# Altium schematic sheet 03 MAIN POWER.SchDoc
size 513 x 386 mm
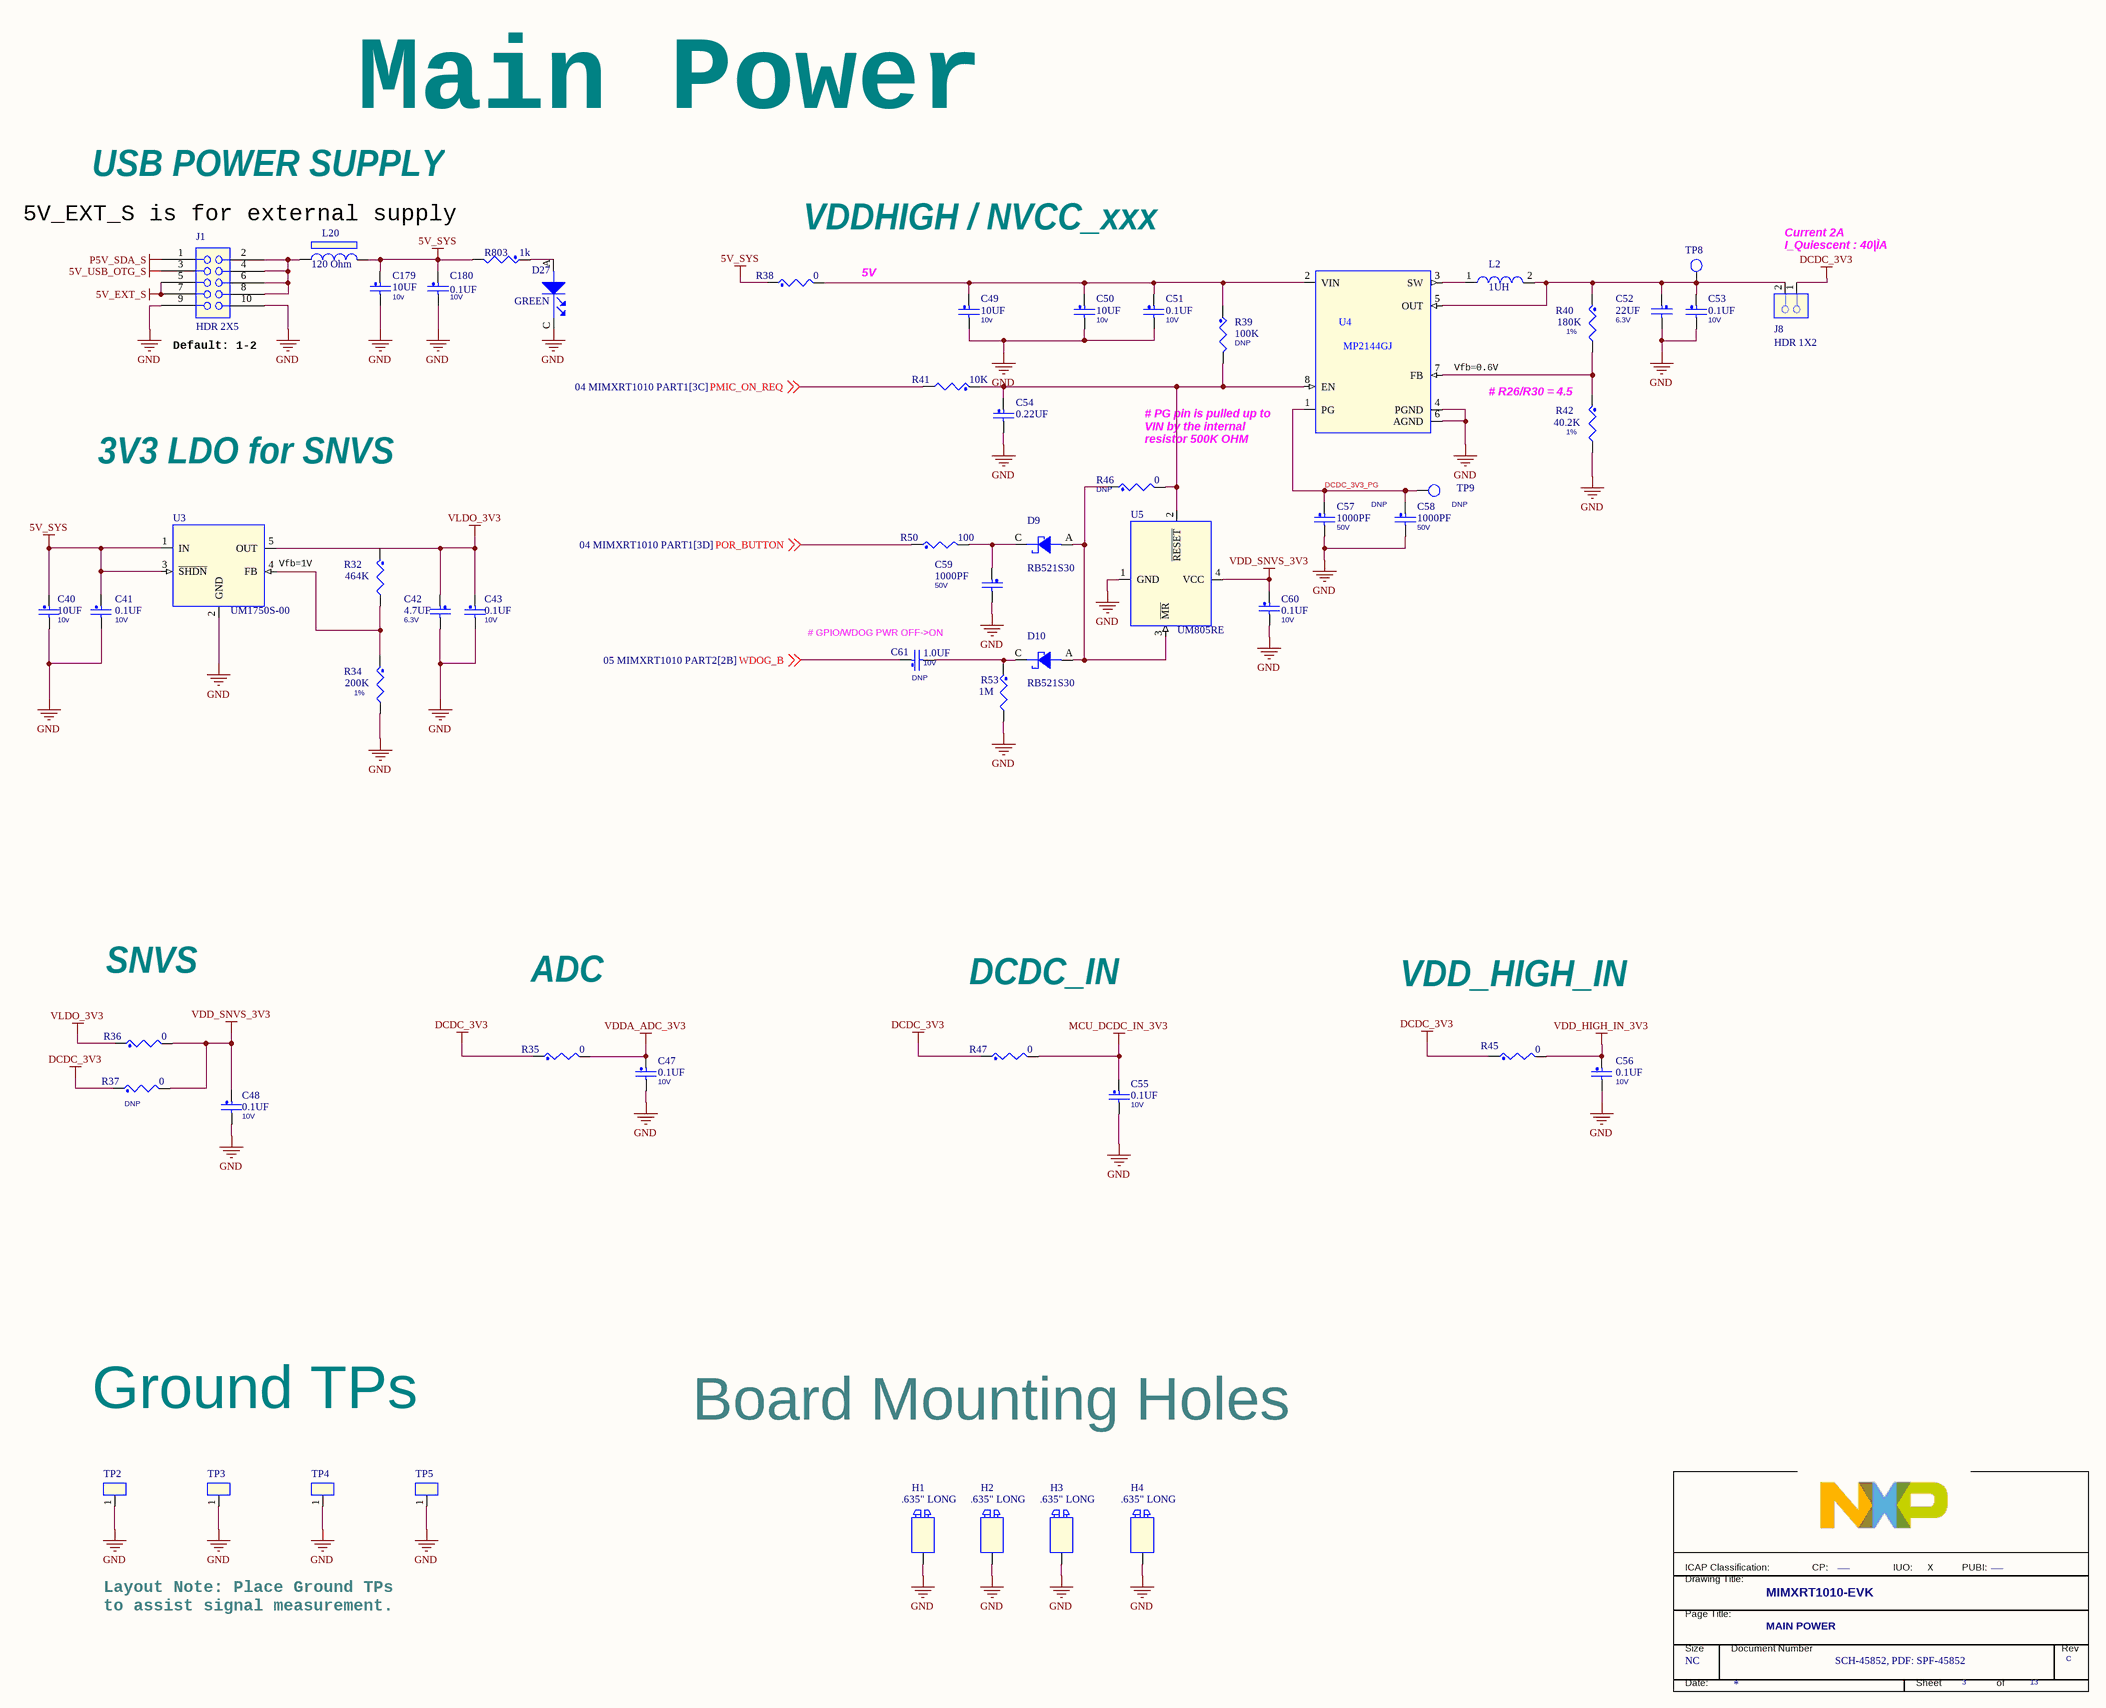
[diagram p0: 03 MAIN POWER.SchDoc]

## Parts
*  PUBI: ___  Doc: SCH-45852, PDF: SPF-45852  RevCode: C  Title: MIMXRT1010-EVK  Page Size: NC  Page Number: 3  Page Count: 13  PageTitle: MAIN POWER  (hidden comment: TitleBlock_FS)  (graphical)
C40  10UF  VOLTAGE: 10v  [CC0603_OV]
C41  0.1UF  VOLTAGE: 10V  [CC0402_25]
C42  4.7UF  voltage rating: 6.3V  [0402_CC]
C43  0.1UF  VOLTAGE: 10V  [CC0402_25]
C47  0.1UF  VOLTAGE: 10V  [CC0402_25]
C48  0.1UF  VOLTAGE: 10V  [CC0402_25]
C49  10UF  VOLTAGE: 10v  [CC0603_OV]
C50  10UF  VOLTAGE: 10v  [CC0603_OV]
C51  0.1UF  VOLTAGE: 10V  [CC0402_25]
C52  22UF  voltage rating: 6.3V  [0603_CC]
C53  0.1UF  VOLTAGE: 10V  [CC0402_25]
C54  0.22UF  [0402_CC]
C55  0.1UF  VOLTAGE: 10V  [CC0402_25]
C56  0.1UF  VOLTAGE: 10V  [CC0402_25]
C57  1000PF  ASSY_OPT: DNP  VOLTAGE: 50V  [0402_CC]
C58  1000PF  ASSY_OPT: DNP  VOLTAGE: 50V  [0402_CC]
C59  1000PF  VOLTAGE: 50V  [0402_CC]
C60  0.1UF  VOLTAGE: 10V  [CC0402_25]
C61  1.0UF  ASSY_OPT: DNP  VOLTAGE: 10V  [0402_cc]
C179  10UF  VOLTAGE: 10v  [CC0603_OV]
C180  0.1UF  VOLTAGE: 10V  [CC0402_25]
D9  RB521S30  [SOD523]
D10  RB521S30  [SOD523]
D27  GREEN  [LED_0603]
H1  .635" LONG  [spacer_139t]
H2  .635" LONG  [spacer_139t]
H3  .635" LONG  [spacer_139t]
H4  .635" LONG  [spacer_139t]
J1  HDR 2X5  [hdr205]
J8  HDR 1X2  [HDR102]
L2  1UH  [ind_4020]
L20  120 Ohm  [0402_CC]
R32  464K  [0402_CC]
R34  200K  Tolerance: 1%  [0402_CC]
R35  0  [0402_CC]
R36  0  [0402_CC]
R37  0  ASSY_OPT: DNP  [0402_CC]
R38  0  [0402_CC]
R39  100K  ASSY_OPT: DNP  [0402_CC]
R40  180K  Tolerance: 1%  [0402_CC]
R41  10K  [0402_CC]
R42  40.2K  Tolerance: 1%  [0402_CC]
R45  0  [0402_CC]
R46  0  ASSY_OPT: DNP  [0402_CC]
R47  0  [0402_CC]
R50  100  [0402_CC]
R53  1M  [0402_CC]
R803  1k  [0402_CC]
TP2  5006  [tp_th_063]  (value not drawn)
TP3  5006  [tp_th_063]  (value not drawn)
TP4  5006  [tp_th_063]  (value not drawn)
TP5  5006  [tp_th_063]  (value not drawn)
TP8  TP_35MIL  [testpoint_35mil]  (value not drawn)
TP9  TP_35MIL  [testpoint_35mil]  (value not drawn)
U3  UM1750S-00  [sot23-5_a]
U4  MP2144GJ  [tsot23_8_0p65_2x1]
U5  UM805RE  [sot_143]

## Nets
5V_EXT_S: J1.5(A3) J1.7(A4)
5V_SYS: C40.1 C41.1 C179.1 C180.1 L20.2 R38.1 R803.2 U3.1(IN) U3.3(~{SHDN})
5V_USB_OTG_S: J1.3(A2)
DCDC_3V3: J8.1 R35.1 R37.1 R45.1 R47.1
GND: C40.2 C41.2 C42.2 C43.2 C47.2 C48.2 C49.2 C50.2 C51.2 C52.2 C53.2 C54.2 C55.2 C56.2 C57.2 C58.2 C59.2 C60.2 C179.2 C180.2 D27.C(CATHODE) H1.1(NC_1) H2.1(NC_1) H3.1(NC_1) H4.1(NC_1) J1.9(A5) J1.10(B5) R34.2 R42.2 R53.2 TP2.1 TP3.1 TP4.1 TP5.1 U3.2(GND) U4.4(PGND) U4.6(AGND) U5.1(GND)
MCU_DCDC_IN_3V3: C55.1 R47.2
P5V_SDA_S: J1.1(A1)
VDD_HIGH_IN_3V3: C56.1 R45.2
VDD_SNVS_3V3: C48.1 C60.1 R36.2 R37.2 U5.4(VCC)
VDDA_ADC_3V3: C47.1 R35.2
VLDO_3V3: C42.1 C43.1 R32.1 R36.1 U3.5(OUT)
DCDC_3V3_PG: C57.1 C58.1 TP9.1(TP) U4.1(PG)
PMIC_ON_REQ: R41.2 ; off-sheet PMIC_ON_REQ
POR_BUTTON: R50.1 ; off-sheet POR_BUTTON
WDOG_B: C61.1 ; off-sheet WDOG_B
NetC49_1: C49.1 C50.1 C51.1 R38.2 R39.1 U4.2(VIN)
NetC52_1: C52.1 C53.1 J8.2 L2.2 R40.1 TP8.1(TP) U4.5(OUT)
NetC54_1: C54.1 R39.2 R41.1 R46.2 U4.8(EN) U5.2(~{RESET})
NetC59_1: C59.1 D9.C R50.2
NetC61_2: C61.2 D10.C R53.1
NetD9_A: D9.A D10.A R46.1 U5.3(~{MR})
NetD27_A: D27.A(ANODE) R803.1
NetJ1_2: J1.2(B1) J1.4(B2) J1.6(B3) J1.8(B4) L20.1
NetL2_1: L2.1 U4.3(SW)
NetR32_2: R32.2 R34.1 U3.4(FB)
NetR40_2: R40.2 R42.1 U4.7(FB)

## Notes on the sheet
- Main Power
- 5V_EXT_S is for external supply
- USB POWER SUPPLY
- VDDHIGH / NVCC_xxx
- 5V
- (near J8) Current 2A
  I_Quiescent : 40|ÌA
- (near J1) Default: 1-2
- (near U4) Vfb=0.6V
- (near R42) # R26/R30 = 4.5
- (near U4) # PG pin is pulled up to
  VIN by the internal
  resistor 500K OHM
- 3V3 LDO for SNVS
- (near U3) Vfb=1V
- (near C61) # GPIO/WDOG PWR OFF->ON
- SNVS
- ADC
- DCDC_IN
- VDD_HIGH_IN
- Ground TPs
- Board Mounting Holes
- Layout Note: Place Ground TPs
  to assist signal measurement.
- X
- (in symbol TitleBlock_FS) ICAP Classification:; CP:; IUO:; PUBI:; Drawing Title:; Page Title:; Size; Document Number; Rev; Date:; Sheet; of

## Library data of the parts
* = TitleBlock_FS: FIUO: _X_; OrgAddr2: Austin, TX 78735-8598; OrgAddr1: 6501 William Cannon Drive West; OrgName: Freescale Semiconductor; FCP: ___; Page Create Date: March  8, 1995; Page Modify Date: *
C40 C49 = CAP_NP: CAP CER 10UF 10V 10% X5R 0603; CLASS: DISCRETE; FPLIST: CC0603_OV,CC0603,0603_CC; CAD_APPROVED: Yes; Temp_Range: -55¡ãC ~ 85¡ãC; MFG_PN01: GRM188R61A106KE69D; MFG_NAME01: MURATA; AGILE_PN: 150-78675; PCB Footprint: CC0603_OV; HEIGHT: 1.016MM; ROHS: Yes; Tolerance: 10%
C41 C43 C47 C48 C55 C56 = CAP_NP: CAP CER 0.1UF 10V 10% X5R 0402; CLASS: DISCRETE; FPLIST: CC0402_25,CC0402_HD,0402_CC; CAD_APPROVED: Yes; MFG_PN01: CC0402KRX5R6BB104; MFG_NAME01: YAGEO AMERICA; AGILE_PN: 150-75634; PCB Footprint: CC0402_25; HEIGHT: 0.64MM; ROHS: Yes; Tolerance: 10%
C42 = CAP_NP: CAP CER 4.7UF 6.3V 20% X5R 0402; CLASS: DISCRETE; FPLIST: CC0402_25,CC0402_HD,0402_CC; CAD_APPROVED: Yes; MFG_PN01: C1005X5R0J475M050BC; MFG_NAME01: TDK; AGILE_PN: 150-78463; PCB Footprint: 0402_CC; HEIGHT: 0.65MM; ROHS: Yes; Tolerance: 20%; VOLTAGE: 6.3V
C50 C179 = CAP_NP: CAP CER 10UF 10V 10% X5R 0603; CLASS: DISCRETE; AGILE_PN: 150-78675; MFG_NAME01: MURATA; MFG_PN01: GRM188R61A106KE69D; Temp_Range: -55¡ãC ~ 85¡ãC; CAD_APPROVED: Yes; FPLIST: CC0603_OV,CC0603,0603_CC; PCB Footprint: CC0603_OV; Tolerance: 10%; ROHS: Yes; HEIGHT: 1.016MM
C51 C53 C60 C180 = CAP_NP: CAP CER 0.1UF 10V 10% X5R 0402; CLASS: DISCRETE; AGILE_PN: 150-75634; MFG_NAME01: YAGEO AMERICA; MFG_PN01: CC0402KRX5R6BB104; CAD_APPROVED: Yes; FPLIST: CC0402_25,CC0402_HD,0402_CC; PCB Footprint: CC0402_25; Tolerance: 10%; ROHS: Yes; HEIGHT: 0.64MM
C52 = CAP_NP: CAP CER 22UF 6.3V 20% X5R 0603; CLASS: DISCRETE; AGILE_PN: 150-78467; MFG_NAME01: Samsung; MFG_PN01: CL10A226MQ8NRNE; CAD_APPROVED: Yes; FPLIST: CC0603_OV,CC0603,0603_CC; PCB Footprint: 0603_CC; Tolerance: 20%; ROHS: Yes; HEIGHT: 1MM; VOLTAGE: 6.3V
C54 = CAP_NP: CAP CER 0.22UF 6.3V 20% X5R 0402; CLASS: DISCRETE; AGILE_PN: 150-76271; MFG_NAME01: KEMET; MFG_PN01: C0402C224M9PAC; CAD_APPROVED: Yes; FPLIST: CC0402_25,CC0402_HD,0402_CC; PCB Footprint: 0402_CC; Tolerance: 20%; ROHS: Yes; HEIGHT: 0.55MM; VOLTAGE: 6.3V
C57 = CAP_NP: CAP CER 1000PF 50V 5% C0G 0402; CLASS: DISCRETE; FPLIST: CC0402_25,CC0402_HD,0402_CC; CAD_APPROVED: Yes; MFG_PN01: GRM1555C1H102JA01D; MFG_NAME01: MURATA; AGILE_PN: 150-76334; PCB Footprint: 0402_CC; HEIGHT: 0.55MM; ROHS: Yes; Tolerance: 5%
C58 C59 = CAP_NP: CAP CER 1000PF 50V 5% C0G 0402; CLASS: DISCRETE; AGILE_PN: 150-76334; MFG_NAME01: MURATA; MFG_PN01: GRM1555C1H102JA01D; CAD_APPROVED: Yes; FPLIST: CC0402_25,CC0402_HD,0402_CC; PCB Footprint: 0402_CC; Tolerance: 5%; ROHS: Yes; HEIGHT: 0.55MM
C61 = CAP_NP: CAP CER 1.0UF 10V 10% X5R 0402; CLASS: DISCRETE; FPLIST: CC0402_25,CC0402_HD,0402_CC; CAD_APPROVED: Yes; MFG_PN01: CC0402KRX5R6BB105; MFG_NAME01: YAGEO AMERICA; AGILE_PN: 150-75772; PCB Footprint: 0402_cc; HEIGHT: 0.6MM; ROHS: Yes
D9 = DIODE_SCHTKY: DIODE SCH RECT 200MA 30V AEC-Q101 SOD-523; CLASS: IC; AGILE_PN: 480-79672; MFG_NAME01: NEXPERIA; MFG_PN01: RB521S30,115; CAD_APPROVED: Yes; PCB Footprint: SOD523; ROHS: Yes; HEIGHT: 0.65MM
D10 = DIODE_SCHTKY: DIODE SCH RECT 200MA 30V AEC-Q101 SOD-523; CLASS: IC; CAD_APPROVED: Yes; MFG_PN01: RB521S30,115; MFG_NAME01: NEXPERIA; AGILE_PN: 480-79672; PCB Footprint: SOD523; HEIGHT: 0.65MM; ROHS: Yes
D27 = LED: LED GRN SGL 25MA 0603; CLASS: IC; AGILE_PN: 370-76549; MFG_NAME01: KINGBRIGHT; MFG_PN01: KPT-1608SGC; CAD_APPROVED: Yes; PCB Footprint: LED_0603; ROHS: Yes; HEIGHT: 0.85MM
H1-H4 = SPACER: FASTENER, STANDOFF 4.5MMX3.53XM3.0X0.5 ROUND THR .635"L BRASS; CLASS: IC; CAD_APPROVED: Yes; ASSY_OPT: DNP; MFG_PN01: MSS251-R-1-A-16; MFG_NAME01: UNICORP; AGILE_PN: 280-76498; PCB Footprint: spacer_139t; HEIGHT: 16.13MM; ROHS: Yes
J1 = CONN_HDR_5X2: HDR 2X5 TH 100MIL CTR 338H AU 98L; CLASS: IO; CAD_APPROVED: Yes; Temp_Range: -55DegC to +105DegC; MFG_PN01: 0902S1005011N9T-31RF; MFG_NAME01: ANYTRONIC CORPORATION LIMITED; AGILE_PN: 210-81467; PCB Footprint: hdr205; HEIGHT: 8.59MM; ROHS: Yes
J8 = CONN_HDR_2X1: HDR 1X2 TH 100MIL SP 339H AU 98L; CLASS: IO; AGILE_PN: 210-81490; MFG_NAME01: ANYTRONIC CORPORATION LIMITED; MFG_PN01: 0901S0202011N9T-31RF; Temp_Range: -55¡ãC to +105¡ãC; CAD_APPROVED: Yes; PCB Footprint: HDR102; ROHS: Yes; HEIGHT: 8.59MM
L2 = IND: IND PWR 1UH@100KHZ 2.6A 30% SMT; PART_TYPE: INDUCTOR\POWER; CLASS: DISCRETE; AGILE_PN: 180-77797; MFG_NAME01: Shenzhen Sunlord Electronics Co., Ltd; MFG_PN01: SWPA4020S1R0NT; CAD_APPROVED: Yes; PCB Footprint: ind_4020; Tolerance: 30%; TOL: 30%; ROHS: Yes; HEIGHT: 2.2MM
L20 = INDUCTOR_FERRITE: IND FER BEAD 120 OHM@100MHZ 0.5A 25% 0402; PART_TYPE: FERRITE\BEAD; CLASS: DISCRETE; FPLIST: IND_0402,0402_CC; CAD_APPROVED: Yes; MFG_PN01: BLM15AG121SN1D; MFG_NAME01: Murata; AGILE_PN: 180-77771; PCB Footprint: 0402_CC; HEIGHT: 0.55MM; ROHS: Yes; Tolerance: 25%
R32 = RES_Dup1: RES MF 464K 1/10W 1% AEC-Q200 0402; CLASS: DISCRETE; Temp_Range: -55C to +155C; AGILE_PN: 470-31135; MFG_NAME01: KOA SPEER; MFG_PN01: RK73H1ETTP4643F; CAD_APPROVED: Yes; FPLIST: RC0402_25,RC0402_HD,0402_CC; PCB Footprint: 0402_CC; Tolerance: 1%; ROHS: Yes; HEIGHT: 0.40 MM
R34 = RES_Dup1: RES MF 200K 1/10W 1% AEC-Q200 0402; CLASS: DISCRETE; AGILE_PN: 470-31093; MFG_NAME01: KOA SPEER; MFG_PN01: RK73H1ETTP2003F; CAD_APPROVED: Yes; FPLIST: RC0402_25,RC0402_HD,0402_CC; Temp_Range: -55C to +155C; PCB Footprint: 0402_CC; HEIGHT: 0.40 MM; ROHS: Yes
R35 R36 R38 R47 = RES_Dup1: RES MF ZERO OHM 1/16W 5% 0402; CLASS: DISCRETE; FPLIST: RC0402_25,RC0402_HD,RC0402_X2,0402_CC; CAD_APPROVED: Yes; MFG_PN01: MCR01MZPJ000; MFG_NAME01: ROHM; AGILE_PN: 470-75394; PCB Footprint: 0402_CC; ROHS: Yes; Tolerance: 5%; HEIGHT: 0.45 MM
R37 R45 R46 = RES_Dup1: RES MF ZERO OHM 1/16W 5% 0402; CLASS: DISCRETE; AGILE_PN: 470-75394; MFG_NAME01: ROHM; MFG_PN01: MCR01MZPJ000; CAD_APPROVED: Yes; FPLIST: RC0402_25,RC0402_HD,RC0402_X2,0402_CC; PCB Footprint: 0402_CC; HEIGHT: 0.45 MM; Tolerance: 5%; ROHS: Yes
R39 = RES_Dup1: RES MF 100K 1/16W 5% 0402; CLASS: DISCRETE; FPLIST: RC0402_25,RC0402_HD,0402_CC; CAD_APPROVED: Yes; MFG_PN01: CR0402-16W-104JT; MFG_NAME01: VENKEL COMPANY; AGILE_PN: 470-75597; Temp_Range: -55C to +155C; PCB Footprint: 0402_CC; HEIGHT: 0.40 MM; ROHS: Yes; Tolerance: 5%
R40 = RES_Dup1: RES MF 180K 1/10W 1% AEC-Q200 0402; CLASS: DISCRETE; Temp_Range: -55C to +155C; FPLIST: RC0402_25,RC0402_HD,0402_CC; CAD_APPROVED: Yes; MFG_PN01: RK73H1ETTP1803F; MFG_NAME01: KOA SPEER; AGILE_PN: 470-31088; PCB Footprint: 0402_CC; HEIGHT: 0.40 MM; ROHS: Yes
R41 = RES_Dup1: RES MF 10K 1/16W 5% 0402; CLASS: DISCRETE; AGILE_PN: 470-75557; MFG_NAME01: VISHAY INTERTECHNOLOGY; MFG_PN01: CRCW040210K0JNED; CAD_APPROVED: Yes; FPLIST: RC0402_25,RC0402_HD,0402_CC; PCB Footprint: 0402_CC; Tolerance: 5%; ROHS: Yes; HEIGHT: 0.4 MM
R42 = RES_Dup1: RES MF 40.2K  1/16W 1% 0402; CLASS: DISCRETE; Temp_Range: -55C to +155C; FPLIST: RC0402_25,RC0402_HD,0402_CC; CAD_APPROVED: Yes; MFG_PN01: RC0402FR-0740K2L; MFG_NAME01: YAGEO AMERICA; AGILE_PN: 470-31015; PCB Footprint: 0402_CC; ROHS: Yes; HEIGHT: 0.40 MM
R50 = RES_Dup1: RES MF 100 OHM 1/16W 1% 0402; CLASS: DISCRETE; FPLIST: RC0402_25,RC0402_HD,0402_CC; CAD_APPROVED: Yes; MFG_PN01: CR-02FL6--100R; MFG_NAME01: THYE MING TECH CO LTD; AGILE_PN: 470-30454; PCB Footprint: 0402_CC; ROHS: Yes; Tolerance: 1%; HEIGHT: 0.4 MM
R53 = RES_Dup1: RES MF 1M 1/10W 5% AEC-Q200 0402; CLASS: DISCRETE; FPLIST: RC0402_25,RC0402_HD,0402_CC; CAD_APPROVED: Yes; MFG_PN01: RK73B1ETTP105J; MFG_NAME01: KOA SPEER; AGILE_PN: 470-79978; Temp_Range: -55&#8451; to 155&#8451;; PCB Footprint: 0402_CC; ROHS: Yes; Tolerance: 5%; HEIGHT: 0.4MM
R803 = RES_Dup1: RES MF 1.0K 1/16W 5% 0402; CLASS: DISCRETE; AGILE_PN: 470-75555; MFG_NAME01: VISHAY INTERTECHNOLOGY; MFG_PN01: CRCW04021K00JNED; CAD_APPROVED: Yes; FPLIST: RC0402_25,RC0402_HD,RC0402_X2,0402_CC; PCB Footprint: 0402_CC; Tolerance: 5%; ROHS: Yes; HEIGHT: 0.41mm
TP2 TP4 = TEST_POINT: TEST POINT BLK 70X220 MIL TH; CLASS: IC; CAD_APPROVED: Yes; MFG_NAME01: Keystone Electronics; AGILE_PN: 210-30155; PCB Footprint: tp_th_063; HEIGHT: 5.6MM; ROHS: Yes; MFG_PN01: 5006
TP3 TP5 = TEST_POINT: TEST POINT BLK 70X220 MIL TH; CLASS: IC; AGILE_PN: 210-30155; MFG_NAME01: Keystone Electronics; CAD_APPROVED: Yes; PCB Footprint: tp_th_063; MFG_PN01: 5006; ROHS: Yes; HEIGHT: 5.6MM
TP8 TP9 = T POINT R: TEST POINT PAD .035 SMT, no part to order; CLASS: IC; AGILE_PN: 510-75618; CAD_APPROVED: Yes; PCB Footprint: testpoint_35mil; ROHS: Yes; HEIGHT: 0.1MM
U3 = UM1750S-00_5P: IC VREG LDO ADJ 1-5V 350mA 2.5-6V SOT23-5; AGILE_PN: 315-80554; MFG_NAME01: Union Semiconductor, Inc; CAD_APPROVED: Yes; CLASS: IC; PCB Footprint: sot23-5_a; MFG_PN01: UM1750S-00; ROHS: Yes; HEIGHT: 1.25MM
U4 = MP2144GJ_TSOT23_8P: IC SYNC STEP-DOWN SW 1.2MHZ 0.6V 2A 2.5-5.5V TSOT23-8; AGILE_PN: 315-80508; MFG_NAME01: MONOLITHIC POWER SYSTEMS; CAD_APPROVED: Yes; CLASS: IC; PCB Footprint: tsot23_8_0p65_2x1; MFG_PN01: MP2144GJ; ROHS: Yes; HEIGHT: 1MM
U5 = UM805_4P: IC VOLT MONITOR 2.63V VTH RST 1-5.5V SOT143; CAD_APPROVED: Yes; MFG_NAME01: Union Semiconductor, Inc; AGILE_PN: 315-80564; CLASS: IC; PCB Footprint: sot_143; HEIGHT: 1.22MM; ROHS: Yes; MFG_PN01: UM805RE